# EAGLE design UPM_pcb_v1-0 (EAGLE 6.6.0)

## Sheet 1 of 3: Power
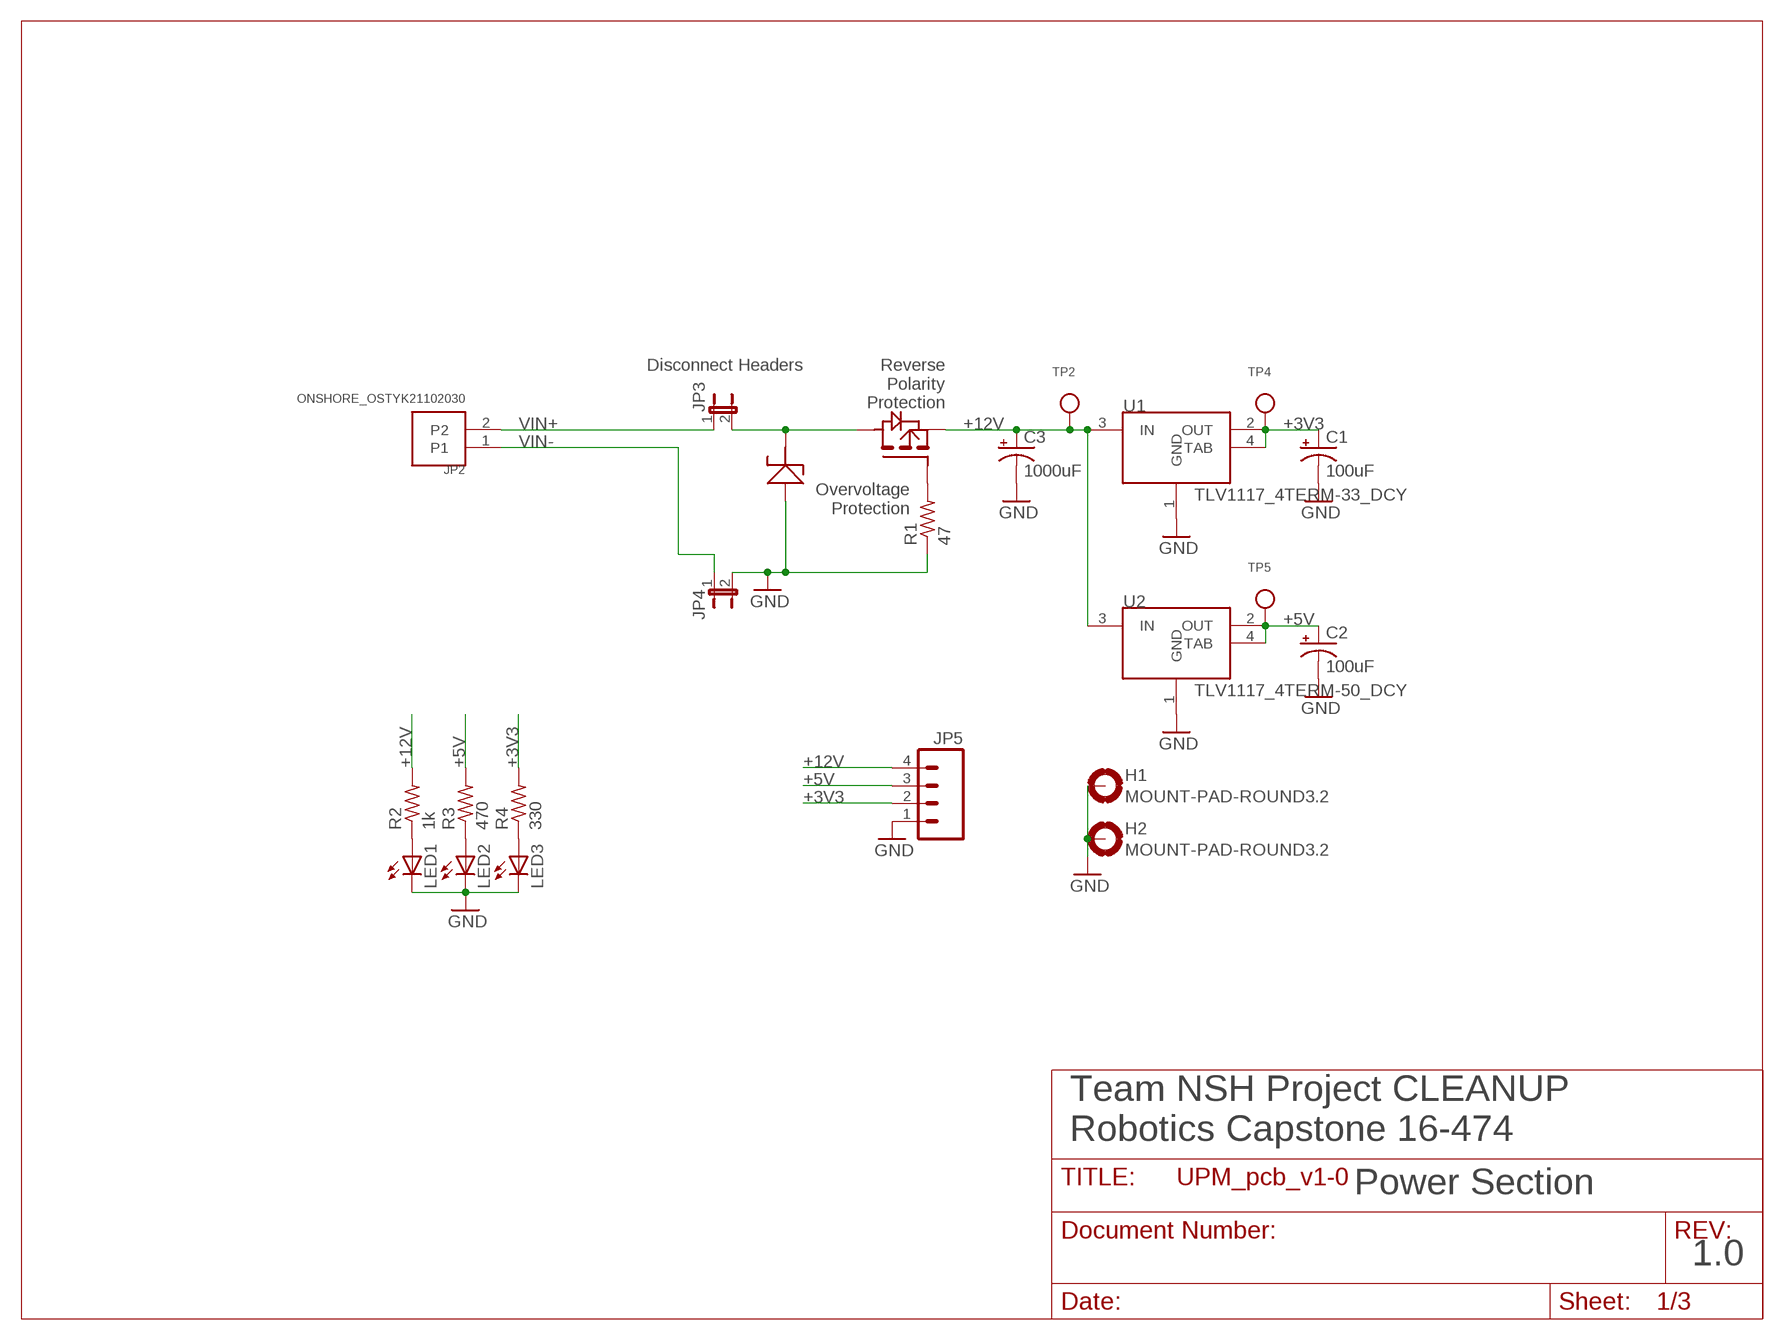
[diagram p0: schematic, sheet 1]

### Parts
C1  100uF  CPOL-USE2.5-5  [E2,5-5]
C2  100uF  CPOL-USE2.5-5  [E2,5-5]
C3  1000uF  CPOL-USE5-13  [E5-13]
D1  VISHAY_SMA6F  [VSHY_DO-221AC]
H1  MOUNT-PAD-ROUND3.2  [3,2-PAD]
H2  MOUNT-PAD-ROUND3.2  [3,2-PAD]
JP2  ONSHORE_OSTYK21102030  [ONSHORE_OSTYK21102030]
JP3  JUMPER2  [JUMPER2]
JP4  JUMPER2  [JUMPER2]
JP5  M04LOCK  [1X04_LOCK]
LED1  LED0603  [LED-0603]
LED2  LED0603  [LED-0603]
LED3  LED0603  [LED-0603]
Q1  DMP4047SK3  [DIODES_TO252]
R1  47  R-US_R0603  [R0603]
R2  1k  R-US_R0603  [R0603]
R3  470  R-US_R0603  [R0603]
R4  330  R-US_R0603  [R0603]
TP2  TESTPOINT0.1"  [1X01_ROUND]
TP4  TESTPOINT0.1"  [1X01_ROUND]
TP5  TESTPOINT0.1"  [1X01_ROUND]
U1  TLV1117_4TERM-33_DCY  [TI_SOT-223_DCY_R-PDSO-G4]
U2  TLV1117_4TERM-50_DCY  [TI_SOT-223_DCY_R-PDSO-G4]

### Nets
+3V3: C1.+ JP5.2 R4.2 TP4.1 U1.2(OUT) U1.4(TAB) ; also sheet 2,3
+5V: C2.+ JP5.3 R3.2 TP5.1 U2.2(OUT) U2.4(TAB) ; also sheet 2,3
+12V: C3.+ JP5.4 Q1.2(S) R2.2 TP2.1 U1.3(IN) U2.3(IN) ; also sheet 3
GND: C1.- C2.- C3.- D1.A H1.B3,2(MOUNT) H2.B3,2(MOUNT) JP4.2 JP5.1 LED1.C LED2.C LED3.C R1.1 U1.1(GND) U2.1(GND) ; also sheet 2,3
N$2: Q1.1(G) R1.2
N$3: D1.K JP3.2 Q1.3(D)
N$4: LED1.A R2.1
N$5: LED2.A R3.1
N$6: LED3.A R4.1
VIN+: JP2.2 JP3.1
VIN-: JP2.1 JP4.1

### Notes on the sheet
- Disconnect Headers
- Reverse
  Polarity
  Protection
- Overvoltage
  Protection
- Team NSH Project CLEANUP
  Robotics Capstone 16-474
- Power Section
- 1.0

## Sheet 2 of 3: CAN
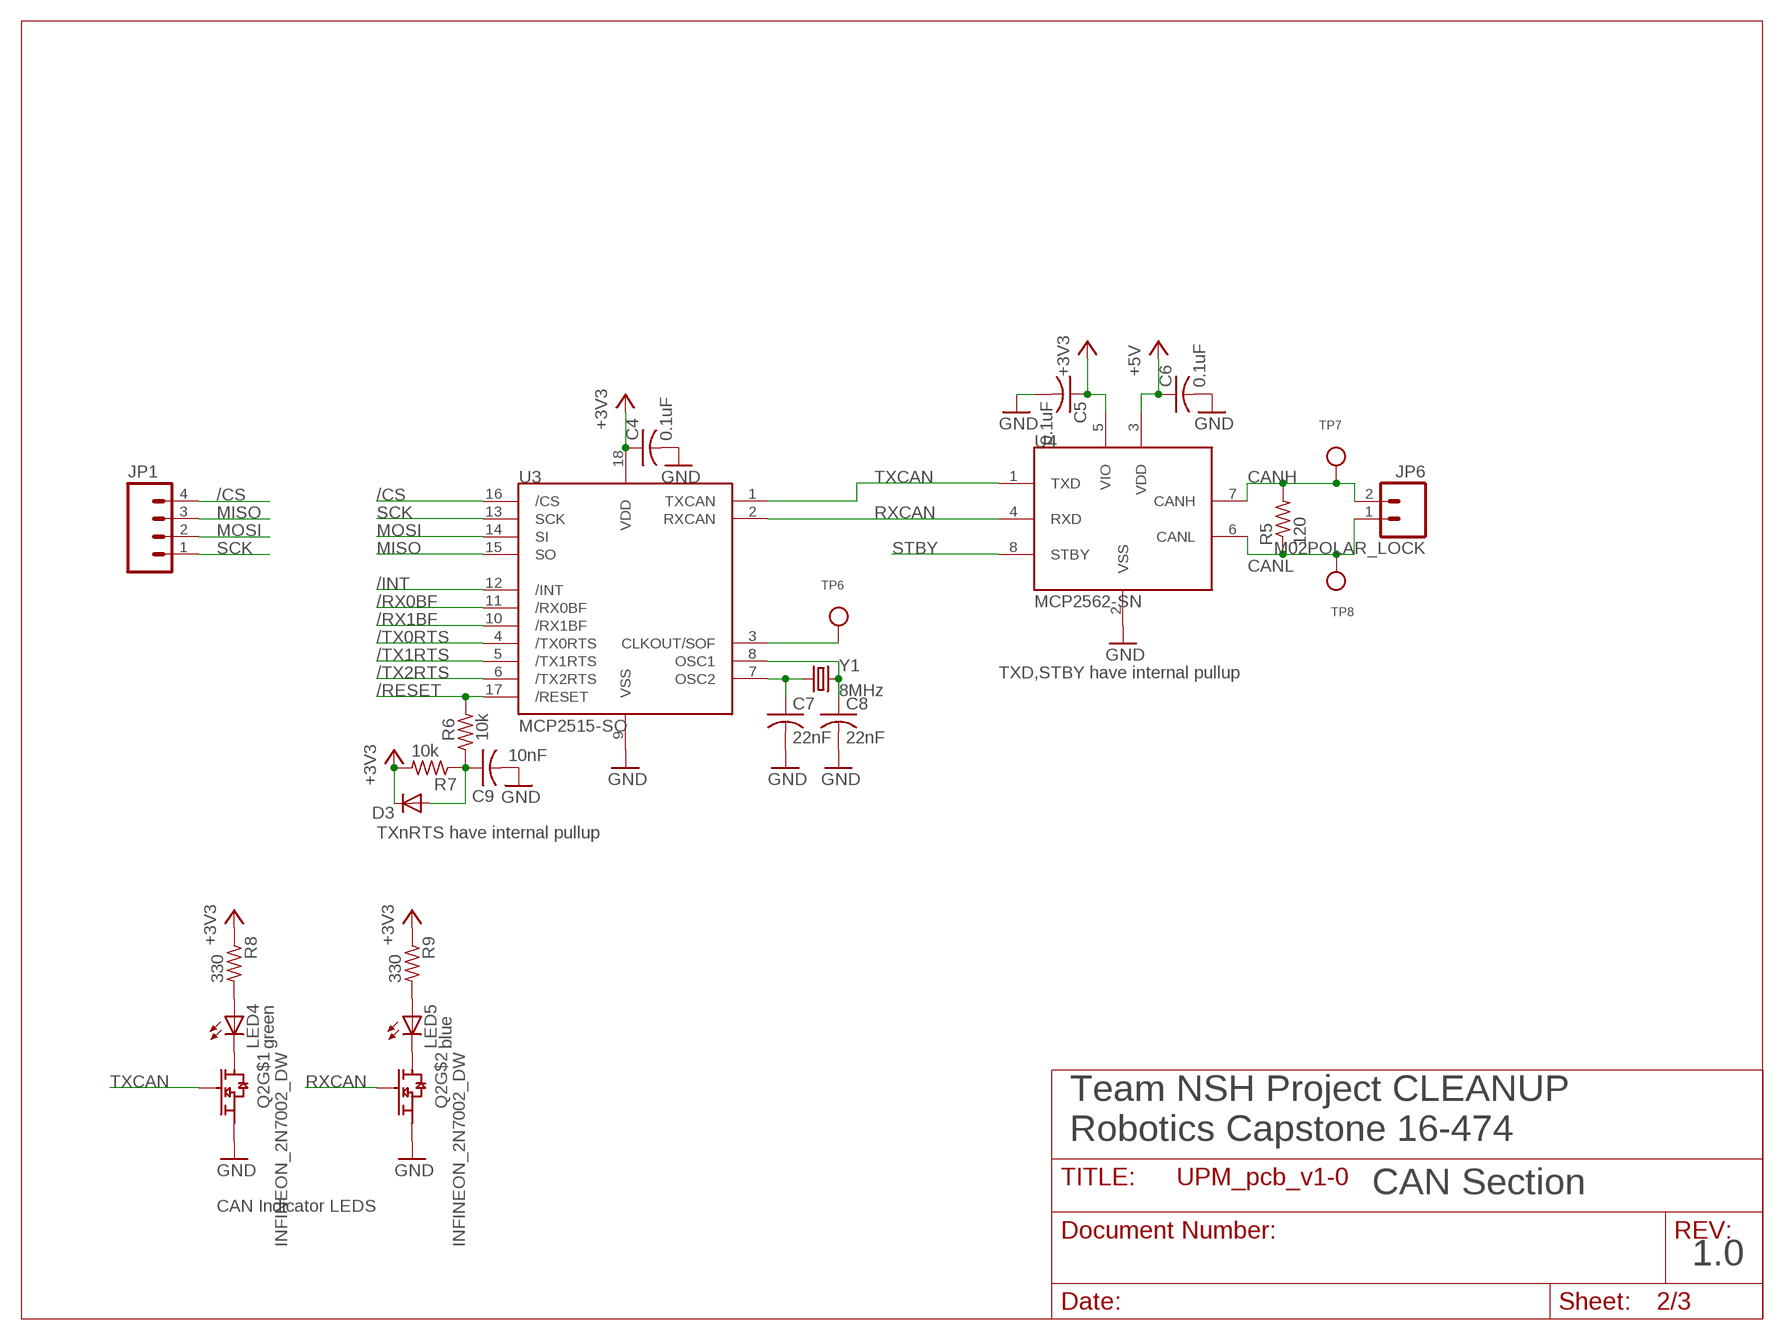
[diagram p1: schematic, sheet 2]

### Parts
C4  0.1uF  C-USC0603  [C0603]
C5  0.1uF  C-USC0603  [C0603]
C6  0.1uF  C-USC0603  [C0603]
C7  22nF  C-USC0603  [C0603]
C8  22nF  C-USC0603  [C0603]
C9  10nF  C-USC0603  [C0603]
D3  DIODE1N4148  [DIODE-1N4148]
JP1  M04LOCK  [1X04_LOCK]
JP6  M02POLAR_LOCK  [MOLEX-1X2_LOCK]
LED4  green  LED0603  [LED-0603]
LED5  blue  LED0603  [LED-0603]
Q2  INFINEON_2N7002_DW  [INFINEON_SOT363]
R5  120  R-US_R0603  [R0603]
R6  10k  R-US_R0603  [R0603]
R7  10k  R-US_R0603  [R0603]
R8  330  R-US_R0603  [R0603]
R9  330  R-US_R0603  [R0603]
TP6  TESTPOINT0.1"  [1X01_ROUND]
TP7  TESTPOINT0.1"  [1X01_ROUND]
TP8  TESTPOINT0.1"  [1X01_ROUND]
U3  MCP2515-SO  [MCP_SO_SOIC-18]
U4  MCP2562-SN  [MCP_SN_SOIC-8]
Y1  8MHz  CRYSTALHC49UV  [HC49U-V]

### Nets
+3V3: C4.1 C5.1 D3.C R7.2 R8.1 R9.1 U3.18(VDD) U4.5(VIO) ; also sheet 1,3
+5V: C6.1 U4.3(VDD) ; also sheet 1,3
/CS: JP1.4 U3.16(/CS) ; also sheet 3
/INT: U3.12(/INT) ; also sheet 3
/RESET: R6.2 U3.17(/RESET) ; also sheet 3
/RX0BF: U3.11(/RX0BF) ; also sheet 3
/RX1BF: U3.10(/RX1BF) ; also sheet 3
/TX0RTS: U3.4(/TX0RTS) ; also sheet 3
/TX1RTS: U3.5(/TX1RTS) ; also sheet 3
/TX2RTS: U3.6(/TX2RTS) ; also sheet 3
CANH: JP6.2 R5.2 TP7.1 U4.7(CANH)
CANL: JP6.1 R5.1 TP8.1 U4.6(CANL)
CLKOUT: TP6.1 U3.3(CLKOUT/SOF)
GND: C4.2 C5.2 C6.2 C7.2 C8.2 C9.2 Q2.1(SOURCE) Q2.4(SOURCE) U3.9(VSS) U4.2(VSS) ; also sheet 1,3
MISO: JP1.3 U3.15(SO) ; also sheet 3
MOSI: JP1.2 U3.14(SI) ; also sheet 3
N$1: LED4.C Q2.6(DRAIN)
N$7: C9.1 D3.A R6.1 R7.1
N$8: LED5.C Q2.3(DRAIN)
N$10: LED4.A R8.2
N$11: LED5.A R9.2
RXCAN: Q2.5(GATE) U3.2(RXCAN) U4.4(RXD)
SCK: JP1.1 U3.13(SCK) ; also sheet 3
STBY: U4.8(STBY) ; also sheet 3
TXCAN: Q2.2(GATE) U3.1(TXCAN) U4.1(TXD)
XTAL1: C8.1 U3.8(OSC1) Y1.2
XTAL2: C7.1 U3.7(OSC2) Y1.1

### Notes on the sheet
- TXD,STBY have internal pullup
- TXnRTS have internal pullup
- Team NSH Project CLEANUP
  Robotics Capstone 16-474
- CAN Section
- CAN Indicator LEDS
- 1.0

## Sheet 3 of 3: Header
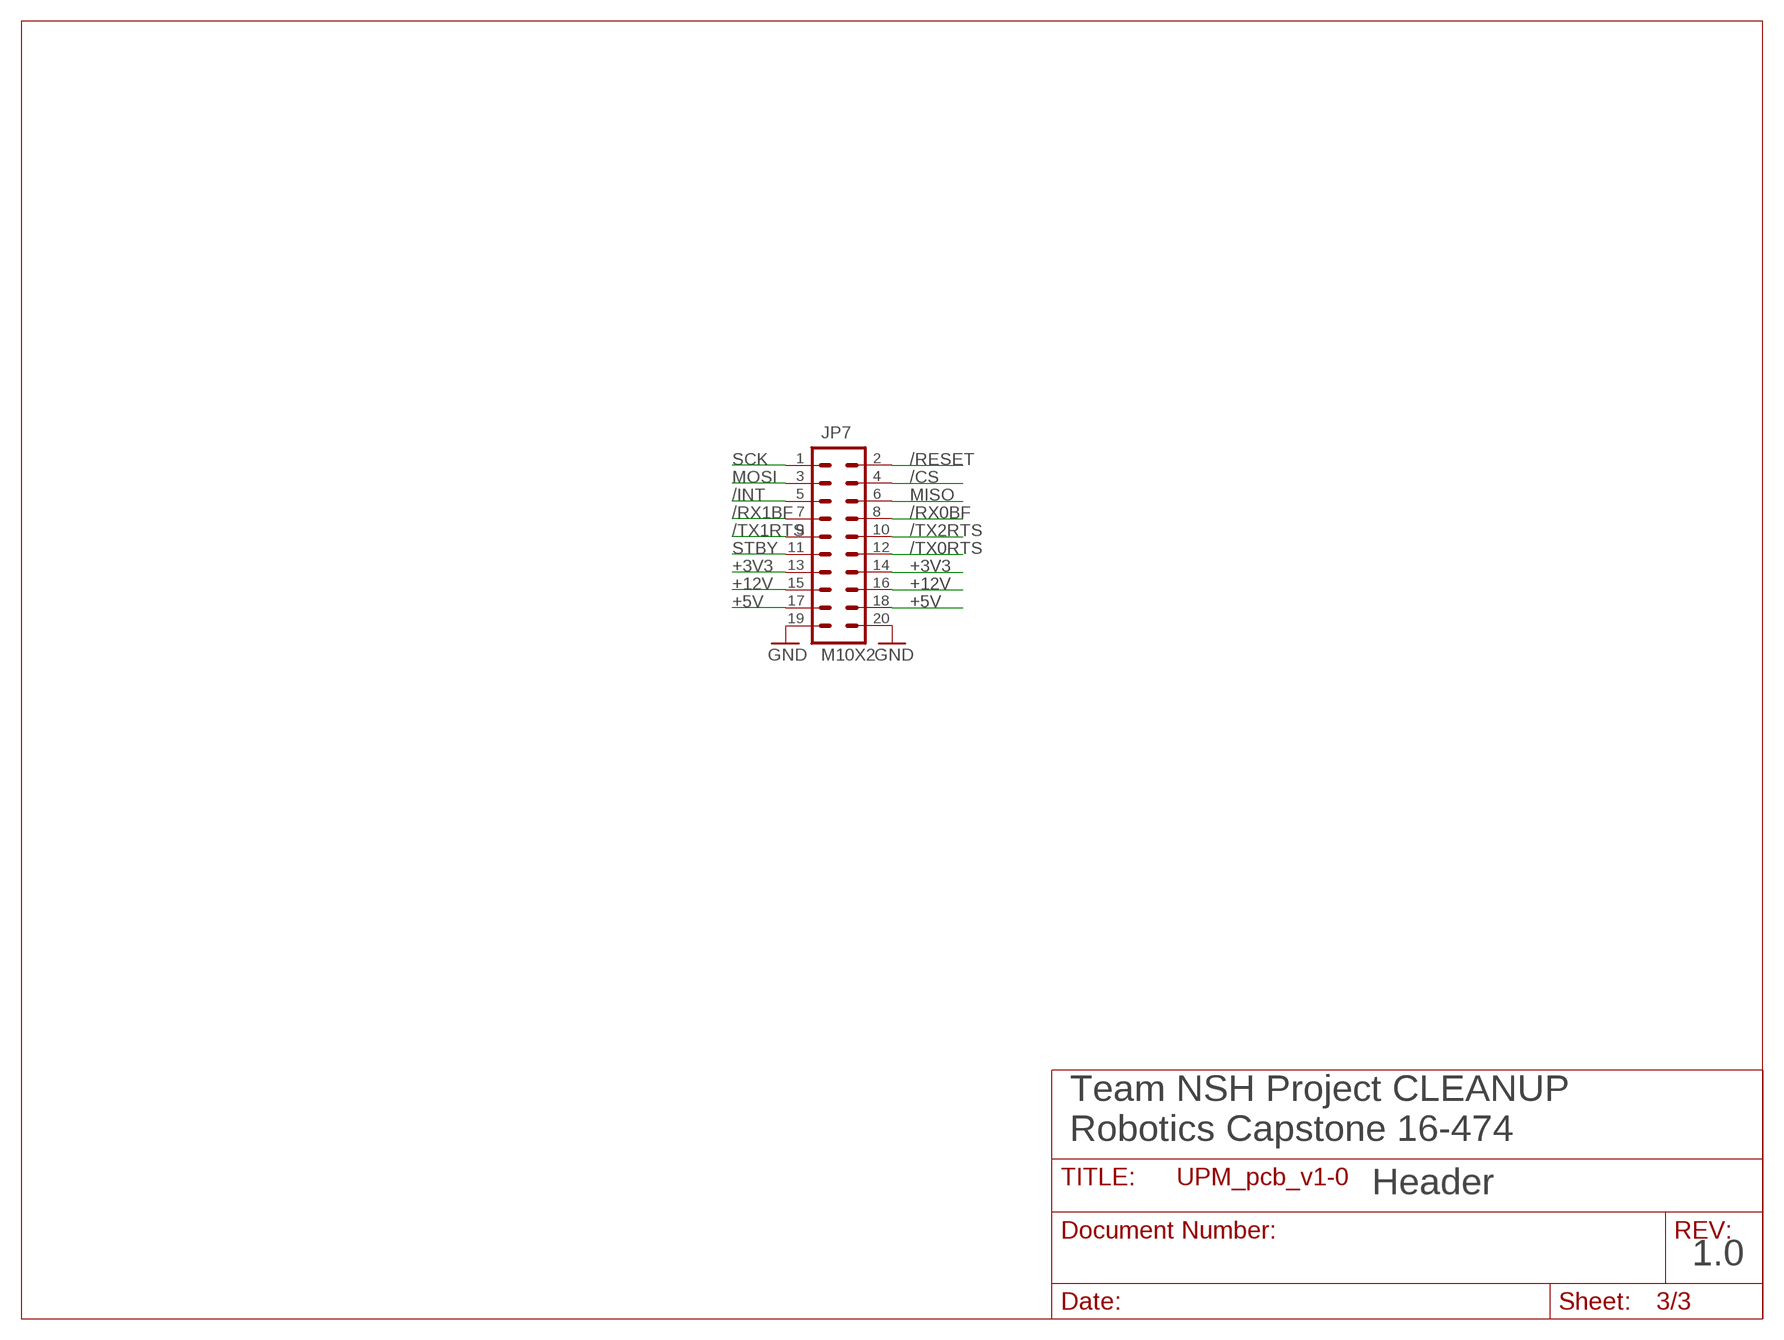
[diagram p2: schematic, sheet 3]

### Parts
JP7  M10X2  [2X10]

### Nets
+3V3: JP7.13 JP7.14 ; also sheet 1,2
+5V: JP7.17 JP7.18 ; also sheet 1,2
+12V: JP7.15 JP7.16 ; also sheet 1
/CS: JP7.4 ; also sheet 2
/INT: JP7.5 ; also sheet 2
/RESET: JP7.2 ; also sheet 2
/RX0BF: JP7.8 ; also sheet 2
/RX1BF: JP7.7 ; also sheet 2
/TX0RTS: JP7.12 ; also sheet 2
/TX1RTS: JP7.9 ; also sheet 2
/TX2RTS: JP7.10 ; also sheet 2
GND: JP7.19 JP7.20 ; also sheet 1,2
MISO: JP7.6 ; also sheet 2
MOSI: JP7.3 ; also sheet 2
SCK: JP7.1 ; also sheet 2
STBY: JP7.11 ; also sheet 2

### Notes on the sheet
- Team NSH Project CLEANUP
  Robotics Capstone 16-474
- Header
- 1.0

## Library data of the parts
C1-C3 = rcl:CPOL-US: POLARIZED CAPACITOR, American symbol
C4-C9 = rcl:C-US: CAPACITOR, American symbol
D1 = npol-discrete:VISHAY_SMA6F
D3 = SparkFun-DiscreteSemi:DIODE: Diode These are standard reverse protection diodes and small signal diodes. SMA package can handle up to about 1A. SOD-323 can handle about 200mA. What the SOD-323 package when ordering, there are some mfgs out there that are 5-pin packages.
H1 H2 = holes:MOUNT-PAD-ROUND: MOUNTING PAD, round
JP1 JP5 = SparkFun-Connectors:M04: Header 4 Standard 4-pin 0.1" header. Use with straight break away headers (SKU : PRT-00116), right angle break away headers (PRT-00553), swiss pins (PRT-00743), machine pins (PRT-00117), and female headers (PRT-00115). Molex polarized connector foot print use with SKU : PRT-08231 with associated crimp pins and housings. 1MM SMD Version SKU: PRT-10208
JP2 = npol-connectors:ONSHORE_OSTYK21102030
JP3 JP4 = microbuilder:JUMPER2: JUMPER - 2 Pins
JP6 = SparkFun-Connectors:M02: Standard 2-pin 0.1" header. Use with - straight break away headers ( PRT-00116) - right angle break away headers (PRT-00553) - swiss pins (PRT-00743) - machine pins (PRT-00117) - female headers (PRT-00115) Molex polarized connector foot print use with: PRT-08233 with associated crimp pins and housings. 2.54_SCREWTERM for use with PRT-10571. 3.5mm Screw Terminal footprints for PRT-08084 5mm Screw Terminal footprints for use with PRT-08433
JP7 = SparkFun-Connectors:M10X2: This was SPECIALLY designed to be used with our Graphic LCD Backpack. Be sure you want to use this! It is not only staggered on each line of header holes, but IT IS ALSO offset of the center point of the top and bottom lines by 5 mil. This causes the headers to lock into place on the "standard" footprint on the LCD screen. The extra squares on the tdocu layer are there simply to reference other pins (if you were to actually populate a longer header than ten long - this is what we do with the backpacks).
LED1-LED5 = SparkFun-LED:LED: LEDs Standard schematic elements and footprints for 5mm, 3mm, 1206, and 0603 sized LEDs. 5mm - Spark Fun Electronics SKU : COM-00529 (and others)
Q1 = npol-discrete:DMP4047SK3
Q2 = npol-discrete:INFINEON_2N7002_DW
R1-R9 = rcl:R-US_: RESISTOR, American symbol
TP2 TP4-TP8 = microbuilder:TESTPOINT: Test Point Various test points for characterisation and PCB testing TESTPOINT_SMT - Compact Surface Mount Test Point [Digikey: 5016KTR-ND]; BOM: EXCLUDE
U1 U2 = npol-power:TLV1117_4TERM
U3 = npol-digital:MCP2515
U4 = npol-digital:MCP2562: High Speed CAN Transceiver
Y1 = SparkFun-FreqCtrl:CRYSTAL: Various standard crystals. Proven footprints. Spark Fun Electronics SKU : COM-00534

## Board
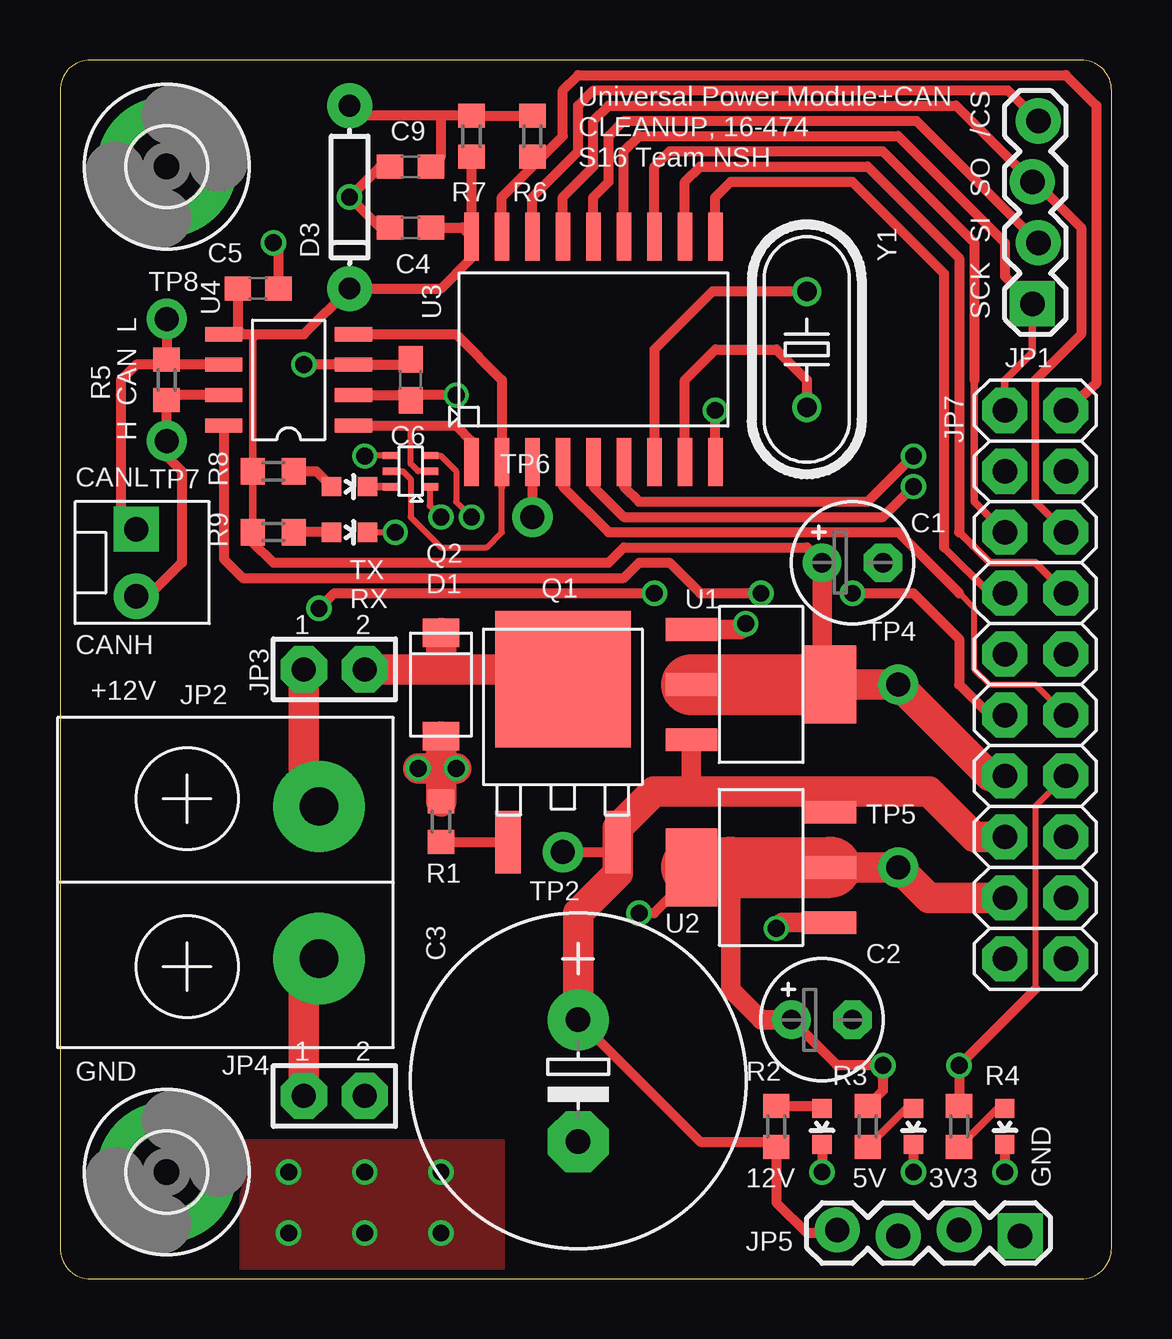
[diagram p3: board, top side]
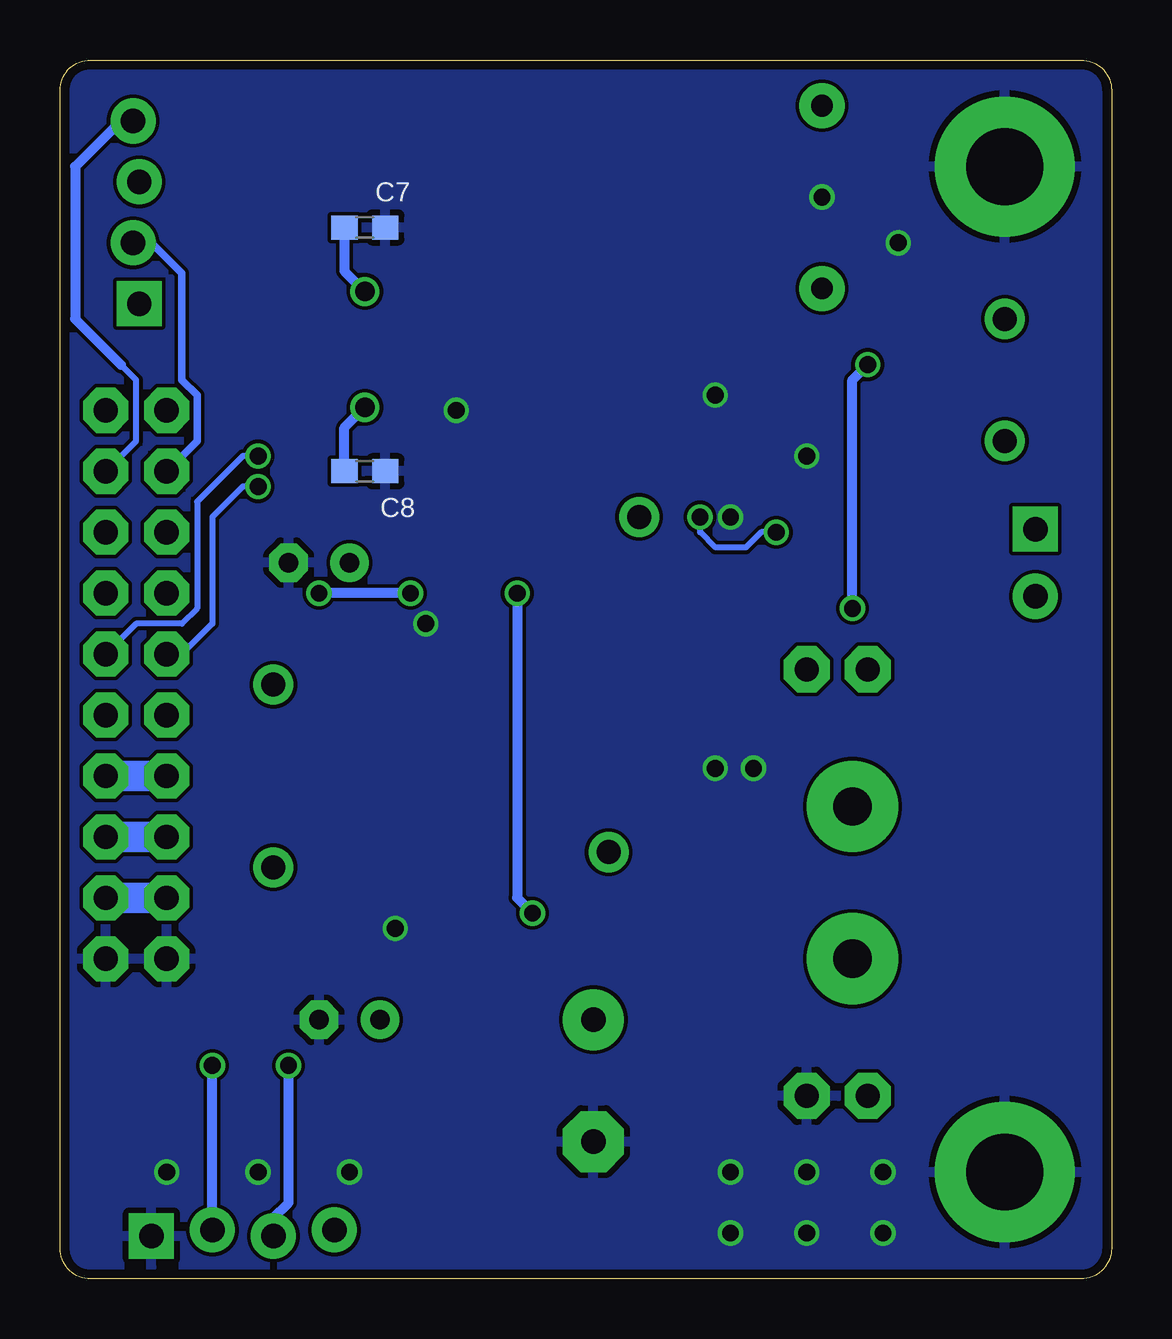
[diagram p4: board, bottom side, seen from below]

Size 43.81 x 50.8 mm. Coordinates in mm from the lower left corner, seen from the top.
Outline: 0,49.53 0,1.27 arc90 1.27,0 42.55,0 arc90 43.81,1.27 43.81,49.53 arc90 42.55,50.8 1.27,50.8 arc90 0,49.53
Copper layers (1*16): Top 0.0356mm / dielectric 1.5011mm / Bottom 0.0356mm
Design rules "OshPark": minimum track width 6mil, minimum drill 13mil, track to track 6mil, track to pad 6mil, pad to pad 6mil, via to via 6mil, smd to smd 6mil, copper to edge 15mil, drill to drill 6mil, minimum pad ring 7mil, minimum via ring 7mil, stop-mask expansion 4mil, vias tented up to drill 0mil, thermal gap 10mil

### Footprints (pad centres in the part's own frame; a part is rotated, then mirrored left to right if it is on the bottom)
E2,5-5 = drill 0.813 pad 1.6: + -1.27,0 | drill 0.813 pad 1.6 octagon: - 1.27,0
E5-13 = drill 1.016 pad 2.54: + -2.54,0 | drill 1.016 pad 2.54 octagon: - 2.54,0
C0603 = smd 1.1 x 1: 1 -0.85,0; 2 0.85,0
VSHY_DO-221AC = smd 1.194 x 1.524: A 2.159,0; K -2.159,0
DIODE-1N4148 = drill 0.9 pad 1.88: A -3.81,0; C 3.81,0
3,2-PAD = drill 3.2 pad 5.842: B3,2 0,0
1X04_LOCK = drill 1.016 pad 1.88 square: 1 0,0.127 | drill 1.016 pad 1.88: 2 2.54,-0.127; 3 5.08,0.127; 4 7.62,-0.127
ONSHORE_OSTYK21102030 = drill 1.6 pad 3.81: 1 -3.175,0; 2 3.175,0
JUMPER2 = drill 1 pad 1.93 octagon: 1 2.54,0; 2 0,0
MOLEX-1X2_LOCK = drill 1.016 pad 1.88 square: 1 -0.127,0 | drill 1.016 pad 1.88: 2 2.667,0
2X10 = drill 1.016 pad 1.88 octagon: 1 -11.43,-1.27; 2 -11.43,1.27; 3 -8.89,-1.27; 4 -8.89,1.27; 5 -6.35,-1.27; 6 -6.35,1.27; 7 -3.81,-1.27; 8 -3.81,1.27; 9 -1.27,-1.27; 10 -1.27,1.27; 11 1.27,-1.27; 12 1.27,1.27; 13 3.81,-1.27; 14 3.81,1.27; 15 6.35,-1.27; 16 6.35,1.27; 17 8.89,-1.27; 18 8.89,1.27; 19 11.43,-1.27; 20 11.43,1.27
LED-0603 = smd 0.8 x 0.8: A 0,-0.75; C 0,0.75
DIODES_TO252 = smd 1.06 x 2.6: 1 -2.286,-3.4; 2 2.286,-3.4 | smd 5.632 x 5.7: 3 0,3.4
INFINEON_SOT363 = smd 0.3 x 0.7: 1 -0.65,-0.8; 2 0,-0.8; 3 0.65,-0.8; 4 0.65,0.8; 5 0,0.8; 6 -0.65,0.8
R0603 = smd 1 x 1.1: 1 -0.85,0; 2 0.85,0
1X01_ROUND = drill 1 pad 1.676: 1 0,0
TI_SOT-223_DCY_R-PDSO-G4 = smd 0.95 x 2.15: 1 -2.3,-2.9; 2 0,-2.9; 3 2.3,-2.9 | smd 3.25 x 2.15: 4 0,2.9
MCP_SO_SOIC-18 = smd 0.6 x 2: 1 -5.08,-4.7; 2 -3.81,-4.7; 3 -2.54,-4.7; 4 -1.27,-4.7; 5 0,-4.7; 6 1.27,-4.7; 7 2.54,-4.7; 8 3.81,-4.7; 9 5.08,-4.7; 10 5.08,4.7; 11 3.81,4.7; 12 2.54,4.7; 13 1.27,4.7; 14 0,4.7; 15 -1.27,4.7; 16 -2.54,4.7; 17 -3.81,4.7; 18 -5.08,4.7
MCP_SN_SOIC-8 = smd 0.6 x 1.55: 1 -1.905,-2.7; 2 -0.635,-2.7; 3 0.635,-2.7; 4 1.905,-2.7; 5 1.905,2.7; 6 0.635,2.7; 7 -0.635,2.7; 8 -1.905,2.7
HC49U-V = drill 0.813: 1 -2.413,0; 2 2.413,0

### Placement (x,y rotation side)
C1  33.02,29.84 0 top
C2  31.75,10.79 0 top
C3  21.59,8.26 270 top
C4  14.61,43.81 180 top
C5  8.26,41.27 0 top
C6  14.61,37.47 270 top
C7  31.11,43.81 0 bottom
C8  31.11,33.66 0 bottom
C9  14.61,46.35 180 top
D1  15.88,24.77 270 top
D3  12.06,45.09 270 top
H1  4.45,4.45 0 top
H2  4.45,46.35 0 top
JP1  40.64,40.64 90 top
JP2  10.79,16.51 90 top
JP3  12.7,25.4 180 top
JP4  12.7,7.62 180 top
JP5  40.01,1.91 180 top
JP6  3.17,31.11 270 top
JP7  40.64,24.77 270 top
LED1  31.75,6.35 180 top
LED2  35.56,6.35 180 top
LED3  39.37,6.35 180 top
LED4  12.06,33.02 270 top
LED5  12.06,31.11 270 top
Q1  20.95,21.59 0 top
Q2  14.61,33.66 90 top
R1  15.88,19.05 270 top
R2  29.84,6.35 270 top
R3  33.66,6.35 90 top
R4  37.47,6.35 90 top
R5  4.45,37.47 270 top
R6  19.68,47.62 270 top
R7  17.14,47.62 270 top
R8  8.89,33.66 0 top
R9  8.89,31.11 0 top
TP2  20.95,17.78 0 top
TP4  34.92,24.77 0 top
TP5  34.92,17.14 0 top
TP6  19.68,31.75 0 top
TP7  4.45,34.92 0 top
TP8  4.45,40.01 0 top
U1  29.21,24.77 270 top
U2  29.21,17.14 90 top
U3  22.23,38.73 0 top
U4  9.53,37.47 90 top
Y1  31.11,38.73 270 top

### Tracks (layer width: path | path; a pad name or v marks a point on that pad's centre or on a via)
+3V3  (via drill 0.7)
  Top 0.254: JP7.14 40.64,19.68 40.64,12.06
  Top 0.305: R9.1 R8.1 8.04,39.16 8.26,39.37
  Top 0.406: C4.1 16.77,43.81 U3.18 | R7.2 U3.18 | U3.18 17.14,42.55 15.88,41.27 D3.C 10.16,39.37 8.26,39.37 7.62,39.37 | U4.5 7.62,39.37 | C5.1 7.41,39.59 7.62,39.37 | R9.1 8.04,30.7 8.89,29.84 22.86,29.84 23.5,30.48 31.11,30.48 C1.+ | 40.64,12.06 v37.47,8.89 R4.2
  Top 0.813: C1.+ 31.75,25.12 U1.4
  Top 1.27: JP7.13 38.73,20.95 TP4.1 U1.4
  Top 2.54: U1.2 U1.4
  Bottom 0.406: JP5.2 v37.47,8.89
  Bottom 1.27: JP7.14 JP7.13
+5V  (via drill 0.7)
  Top 0.406: C6.1 14.39,38.1 U4.3 v10.16,38.1 | v10.79,27.94 11.43,28.57 v24.77,28.57 | v24.13,15.24 24.77,15.24 26.04,16.51 26.04,16.87 U2.4 | C2.+ 32.38,8.89 v34.29,8.89 34.29,7.83 R3.2
  Top 0.813: C2.+ 29.21,10.79 27.94,12.06 27.94,17.14
  Top 1.27: U2.2 TP5.1 36.2,15.88 JP7.17
  Top 2.54: U2.4 27.94,17.14 U2.2
  Bottom 0.406: v10.79,27.94 10.79,37.47 v10.16,38.1 | v24.77,28.57 24.77,15.88 v24.13,15.24 | JP5.3 34.92,2.54 34.29,3.17 v34.29,8.89
  Bottom 1.27: JP7.17 JP7.18
+12V
  Top 0.406: C3.+ 26.67,5.71 29.63,5.71 R2.2 29.84,3.17 31.11,1.91 32.26,1.91 JP5.4 | TP2.1 22.83,17.78 Q1.2
  Top 0.813: U1.3 26.31,20.59 26.04,20.32 | U2.3 32.11,19.96 31.75,20.32
  Top 1.27: C3.+ 21.59,15.24 23.24,16.89 Q1.2 23.24,18.8 24.77,20.32 26.04,20.32 31.75,20.32 36.2,20.32 38.1,18.41 JP7.15
  Bottom 1.27: JP7.16 JP7.15
/CS
  Top 0.406: U3.16 19.68,45.09 21.59,46.99 21.59,48.9 22.23,49.53 39.5,49.53 JP1.4
  Bottom 0.254: JP7.4 40.64,34.92 40.64,37.47 41.27,38.1
  Bottom 0.406: JP1.4 41.4,48.13 43.18,46.35 43.18,40.01 41.27,38.1
/INT
  Top 0.305: JP7.5 38.1,32.38 38.1,37.47
  Top 0.406: U3.12 24.77,46.35 25.4,46.99 34.29,46.99 38.1,43.18 38.1,37.47
/RESET
  Top 0.406: U3.17 18.41,45.09 19.68,46.35 | 19.68,46.35 R6.2 | 19.68,46.35 20.95,47.62 20.95,49.53 21.59,50.16 41.91,50.16 43.18,48.9 43.18,37.34 JP7.2
/RX0BF
  Top 0.305: 37.47,31.11 38.73,29.84 40.64,29.84 JP7.8
  Top 0.406: U3.11 26.04,45.72 26.67,46.35 33.66,46.35 37.47,42.55 37.47,31.11
/RX1BF
  Top 0.305: 36.83,30.48 38.73,28.57 JP7.7
  Top 0.406: U3.10 27.3,45.09 27.94,45.72 33.02,45.72 36.83,41.91 36.83,30.48
/TX0RTS
  Top 0.254: JP7.12 40.64,24.77 38.73,24.77 38.1,25.4 38.1,27.94 37.47,28.57
  Top 0.406: U3.4 20.95,33.02 22.86,31.11 34.92,31.11 37.47,28.57
/TX1RTS  (via drill 0.7)
  Top 0.406: U3.5 22.23,33.02 23.5,31.75 34.29,31.75 v35.56,33.02
  Bottom 0.254: v35.56,33.02 36.2,33.02 37.47,31.75 37.47,27.3 38.73,26.04 JP7.9
/TX2RTS  (via drill 0.7)
  Top 0.406: U3.6 23.5,33.02 24.13,32.38 33.66,32.38 v35.56,34.29
  Bottom 0.254: v35.56,34.29 36.2,34.29 38.1,32.38 38.1,27.94 38.73,27.3 40.64,27.3 JP7.10
CANH
  Top 0.406: JP6.2 3.3,28.57 3.81,28.57 5.08,29.84 5.08,33.66 4.45,34.29 TP7.1 R5.2 4.66,36.83 U4.7
CANL
  Top 0.406: U4.6 4.66,38.1 | 4.66,38.1 R5.1 TP8.1 | 4.66,38.1 3.17,38.1 2.54,37.47 2.54,31.88 JP6.1
CLKOUT
  Top 0.406: U3.3 TP6.1
GND  (via drill 0.7)
  Top 0.254: Q2.4 12.71,34.3 v12.7,34.29 | Q2.1 15.4,32.22 v15.88,31.75
  Top 0.406: U3.9 v27.3,36.2 | C9.2 13.34,46.35 v12.06,45.09 13.34,43.81 C4.2 | U4.2 14.39,36.83 C6.2 14.82,36.83 v16.51,36.83 | C5.2 9.11,42.97 v8.89,43.18 | LED1.C v31.75,4.45 | LED2.C v35.56,4.45 | LED3.C v39.37,4.45
  Top 0.813: U2.1 30.09,14.85 v29.84,14.61 | U1.1 28.34,27.07 v28.57,27.3
  Top 1.27: D1.A 15.88,21.59 | 15.88,21.59 15.88,20.95 | 15.88,20.95 R1.1 | v14.92,21.27 15.56,21.27 15.88,20.95 | v16.51,21.27 16.19,21.27 15.88,21.59
  other vias: 9.53,4.45 9.53,1.91 12.7,4.45 12.7,1.91 15.88,4.45 15.88,1.91
  pour Bottom: 0,50.8 43.81,50.8 43.81,0 0,0
  pour Top: 7.62,0 7.62,5.71 18.41,5.71 18.41,0
MISO
  Top 0.305: 40.64,37.47 40.64,32.38 JP7.6
  Top 0.406: U3.15 20.95,45.09 22.23,46.35 22.23,48.26 22.86,48.9 37.34,48.9 JP1.3 40.64,45.72 42.55,43.81 42.55,39.37 40.64,37.47
MOSI
  Top 0.406: U3.14 22.23,45.09 22.86,45.72 22.86,47.62 23.5,48.26 35.69,48.26 JP1.2
  Bottom 0.305: JP1.2 40.01,43.18 38.73,41.91 38.73,37.47 38.1,36.83 38.1,34.92 JP7.3
N$1
  Top 0.305: LED4.C Q2.6
N$2
  Top 0.406: R1.2 18.66,18.2 Q1.1
N$3
  Top 1.27: JP3.2 15.88,25.4 | 15.88,25.4 20.55,25.4 Q1.3 | D1.K 15.88,25.4
N$4
  Top 0.406: R2.1 31.65,7.2 LED1.A
N$5
  Top 0.305: LED2.A 35.26,7.1 R3.1
N$6
  Top 0.305: LED3.A 39.06,7.1 R4.1
N$7
  Top 0.406: C9.1 15.88,46.77 15.88,48.48 | R6.1 R7.1 15.88,48.48 | 15.88,48.48 12.48,48.48 D3.A
N$8  (via drill 0.7)
  Top 0.254: Q2.3 15.86,34.3 16.51,33.66 16.51,32.38 v17.14,31.75 | LED5.C v13.97,31.11
  Bottom 0.254: v13.97,31.11 14.61,31.11 15.24,30.48 16.51,30.48 17.14,31.11 v17.14,31.75
N$10
  Top 0.406: R8.2 10.68,33.66 LED4.A
N$11
  Top 0.406: LED5.A R9.2
RXCAN
  Top 0.254: Q2.5 14.29,33.66 14.61,33.34 14.61,31.75 15.88,30.48 17.78,30.48 18.41,31.11 18.41,33.02
  Top 0.305: 18.41,33.02 U3.2
  Top 0.406: U4.4 16.51,39.37 18.41,37.47 U3.2
SCK
  Top 0.305: JP1.1 40.51,38.61 39.37,37.47 JP7.1
  Top 0.406: U3.13 23.5,46.99 24.13,47.62 34.92,47.62 39.37,43.18 39.37,41.78 JP1.1
STBY  (via drill 0.7)
  Top 0.406: U4.8 6.83,30 7.62,29.21 23.5,29.21 24.13,29.84 25.4,29.84 26.67,28.57 v29.21,28.57 | v33.02,28.57 35.56,28.57 37.47,26.67 37.47,24.77 38.73,23.5 JP7.11
  Bottom 0.406: v29.21,28.57 v33.02,28.57
TXCAN
  Top 0.254: Q2.2 14.92,33.66 14.61,33.97 14.61,35.56
  Top 0.406: U4.1 14.61,35.56 16.51,35.56 17.14,34.92 U3.1
VIN+
  Top 1.27: JP3.1 10.16,20.32 JP2.2
VIN-
  Top 1.27: JP4.1 10.16,12.7 JP2.1
XTAL1
  Top 0.406: U3.8 26.04,37.47 27.3,38.73 29.84,38.73 31.11,37.47 Y1.2
  Bottom 0.406: C8.1 31.96,35.47 Y1.2
XTAL2
  Top 0.406: Y1.1 27.18,41.15 24.77,38.73 U3.7
  Bottom 0.406: C7.1 31.96,42 Y1.1

### Text on the board
tNames: Universal Power Module+CAN | CLEANUP, 16-474 | /CS | S16 Team NSH | SO | SI | SCK | H CAN L | CANL | TX / RX | CANH | +12V | GND | 12V | 5V | 3V3 | GND